# Altium project 万年历.PrjPcb
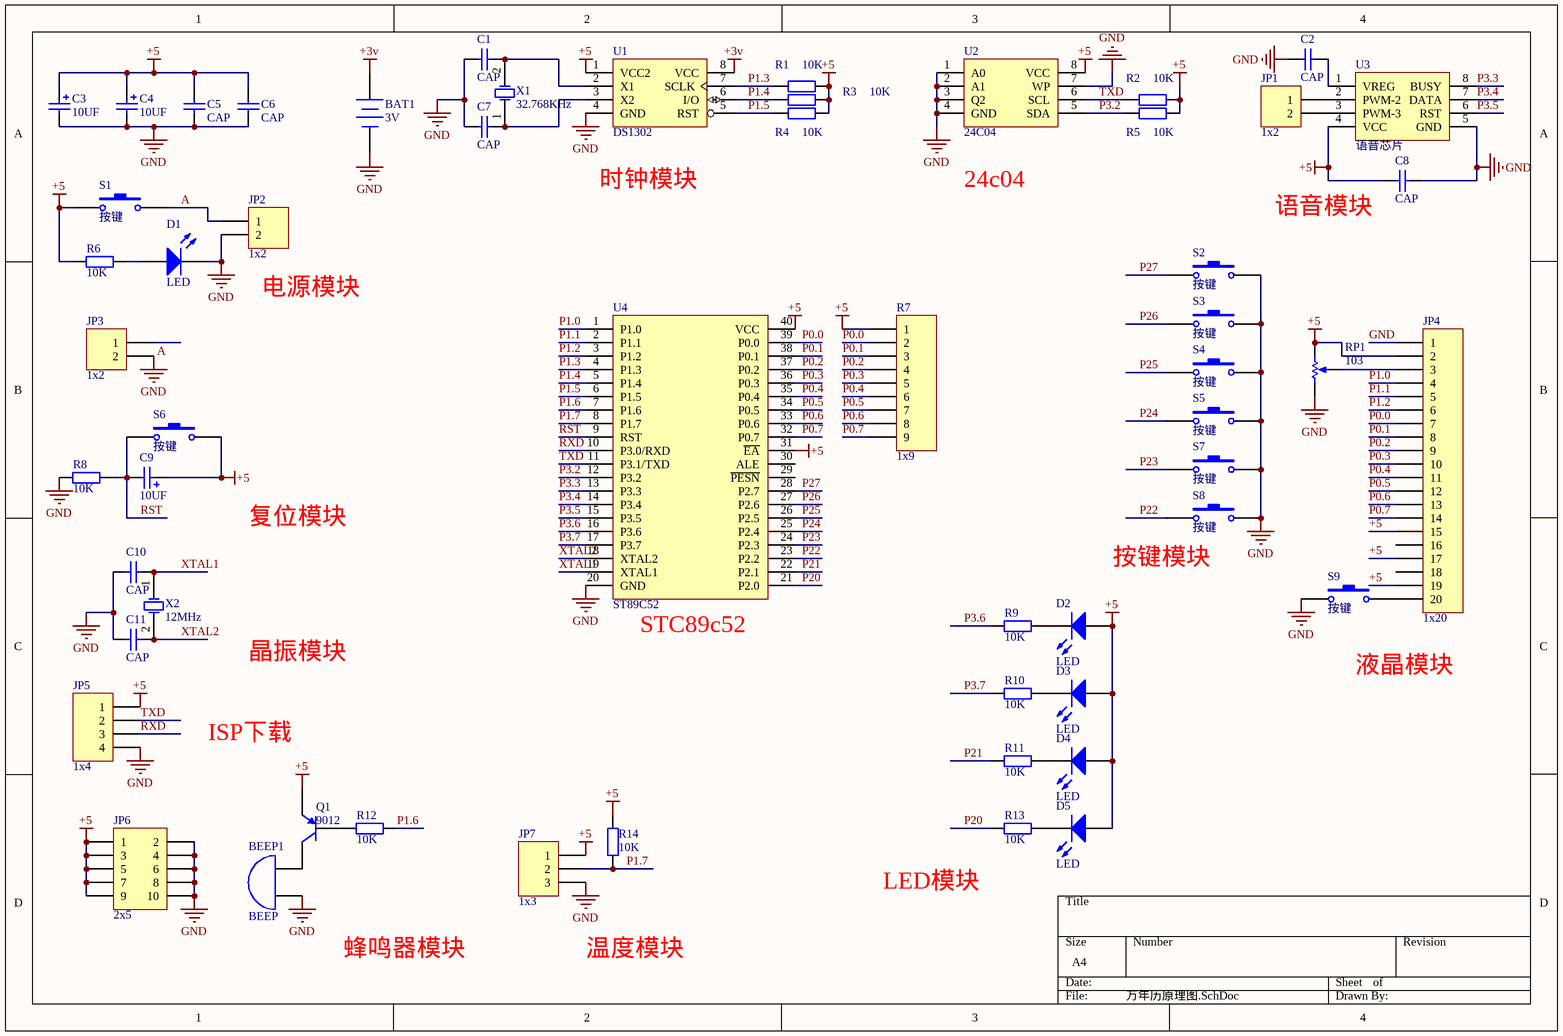
[diagram p0: 万年历原理图.SchDoc]
1 sheet, 56 parts. Net scope: global (net labels, ports and power ports of the same name join across sheets).
Board file: 万年历PCB.PcbDoc

## Sheet 万年历原理图.SchDoc
size A4

### Parts
BAT1  3V  [CR3202]
BEEP1  BEEP  [BEEP]
C1  CAP  [cap-cp]
C2  CAP  [cap-cp]
C3  10UF  [CAP-DJ]
C4  10UF  [CAP-DJ]
C5  CAP  [cap-cp]
C6  CAP  [cap-cp]
C7  CAP  [cap-cp]
C8  CAP  [cap-cp]
C9  10UF  [CAP-DJ]
C10  CAP  [cap-cp]
C11  CAP  [cap-cp]
D1  LED  [0805-led]
D2  LED  [0805-led]
D3  LED  [0805-led]
D4  LED  [0805-led]
D5  LED  [0805-led]
JP1  1x2  [PZ-2]
JP2  1x2  [dc-0005]
JP3  1x2  [5.08DZ]
JP4  1x20  [PZ-20]
JP5  1x4  [PZ-4]
JP6  2x5  [PZ-2x5]
JP7  1x3  [PZ-3]
Q1  9012  [9012-TO-92]
R1  10K  [0805-res]
R2  10K  [0805-res]
R3  10K  [0805-res]
R4  10K  [0805-res]
R5  10K  [0805-res]
R6  10K  [0805-res]
R7  1x9  [PZ-9]
R8  10K  [0805-res]
R9  10K  [0805-res]
R10  10K  [0805-res]
R11  10K  [0805-res]
R12  10K  [0805-res]
R13  10K  [0805-res]
R14  10K  [0805-res]
RP1  103  [VR]
S1  按键  [key-6]
S2  按键  [KEY-4]
S3  按键  [KEY-4]
S4  按键  [KEY-4]
S5  按键  [KEY-4]
S6  按键  [KEY-4]
S7  按键  [KEY-4]
S8  按键  [KEY-4]
S9  按键  [key-6]
U1  DS1302  [DIP8]
U2  24C04  [DIP8]
U3  语音芯片  [DIP8]
U4  ST89C52  [DIP40]
X1  32.768KHz  [32.768khz]
X2  12MHz  [12mhz]

### Nets
+3v: BAT1.1(+) U1.8(VCC)
+5: C3.1 C4.1 C5.2 C6.2 C8.1 C9.1 D2.1(A) D3.1(A) D4.1(A) D5.1(A) JP4.2 JP4.15 JP4.17 JP4.19 JP5.1 JP6.1 JP6.3 JP6.5 JP6.7 JP6.9 JP7.1 Q1.1(E) R1.1 R2.1 R3.1 R4.1 R5.1 R6.2 R7.1 R14.2 RP1.3(BOT) S1.1 S6.2 U1.1(VCC2) U2.8(VCC) U3.4(VCC) U4.31(~{EA}) U4.40(VCC)
GND: BAT1.2(-) BEEP1.2(B) C1.1 C2.2 C3.2 C4.2 C5.1 C6.1 C7.1 C8.2 C10.1 C11.1 D1.2(K) JP2.2 JP3.2 JP4.1 JP5.4 JP6.2 JP6.4 JP6.6 JP6.8 JP6.10 JP7.3 R8.2 RP1.1(TOP) S2.2 S3.2 S4.2 S5.2 S7.2 S8.2 S9.1 U1.4(GND) U2.1(A0) U2.2(A1) U2.3(Q2) U2.4(GND) U2.7(WP) U3.5(GND) U4.20(GND)
A: JP2.1 JP3.1 S1.2
P0.0: JP4.7 R7.2 U4.39(P0.0)
P0.1: JP4.8 R7.3 U4.38(P0.1)
P0.2: JP4.9 R7.4 U4.37(P0.2)
P0.3: JP4.10 R7.5 U4.36(P0.3)
P0.4: JP4.11 R7.6 U4.35(P0.4)
P0.5: JP4.12 R7.7 U4.34(P0.5)
P0.6: JP4.13 R7.8 U4.33(P0.6)
P0.7: JP4.14 R7.9 U4.32(P0.7)
P1.0: JP4.4 U4.1(P1.0)
P1.1: JP4.5 U4.2(P1.1)
P1.2: JP4.6 U4.3(P1.2)
P1.3: R1.2 U1.7(SCLK) U4.4(P1.3)
P1.4: R3.2 U1.6(I/O) U4.5(P1.4)
P1.5: R4.2 U1.5(RST) U4.6(P1.5)
P1.6: R12.2 U4.7(P1.6)
P1.7: JP7.2 R14.1 U4.8(P1.7)
P3.2: R5.2 U2.5(SDA) U4.12(P3.2)
P3.3: U3.8(BUSY) U4.13(P3.3)
P3.4: U3.7(DATA) U4.14(P3.4)
P3.5: U3.6(RST) U4.15(P3.5)
P3.6: R9.1 U4.16(P3.6)
P3.7: R10.1 U4.17(P3.7)
P20: R13.1 U4.21(P2.0)
P21: R11.1 U4.22(P2.1)
P22: S8.1 U4.23(P2.2)
P23: S7.1 U4.24(P2.3)
P24: S5.1 U4.25(P2.4)
P25: S4.1 U4.26(P2.5)
P26: S3.1 U4.27(P2.6)
P27: S2.1 U4.28(P2.7)
RST: C9.2 R8.1 S6.1 U4.9(RST)
RXD: JP5.3 U4.10(P3.0/RXD)
TXD: JP5.2 R2.2 U2.6(SCL) U4.11(P3.1/TXD)
XTAL1: C10.2 U4.19(XTAL1) X2.1(OSC1)
XTAL2: C11.2 U4.18(XTAL2) X2.2(OSC2)
NetBEEP1_1: BEEP1.1(A) Q1.3(C)
NetC1_2: C1.2 U1.2(X1) X1.2(OSC2)
NetC2_1: C2.1 U3.1(VREG)
NetC7_2: C7.2 U1.3(X2) X1.1(OSC1)
NetD1_1: D1.1(A) R6.1
NetD2_2: D2.2(K) R9.2
NetD3_2: D3.2(K) R10.2
NetD4_2: D4.2(K) R11.2
NetD5_2: D5.2(K) R13.2
NetJP1_1: JP1.1 U3.2(PWM-2)
NetJP1_2: JP1.2 U3.3(PWM-3)
NetJP4_3: JP4.3 RP1.2(TAP)
NetJP4_20: JP4.20 S9.2
NetQ1_2: Q1.2(B) R12.1

Not connected (* = marked no-connect by the designer): JP4 16 18; U4 29(~{PESN}) 30(ALE)

### Notes on the sheet
- 时钟模块
- 24c04
- 语音模块
- (near JP2) 电源模块
- 复位模块
- 按键模块
- (near U4) STC89c52
- 晶振模块
- 液晶模块
- ISP下载
- LED模块
- 蜂鸣器模块
- 温度模块

### Library data of the parts
BAT1 = 电池
BEEP1 = 蜂鸣器
C1 C2 C5-C8 C10 C11 = 瓷片电容
C3 C4 C9 = 电解电容
Q1 = PNP
R1-R6 R8-R14 = 电阻
RP1 = 可调电阻
U4 = STC89C52
X1 X2 = 晶振